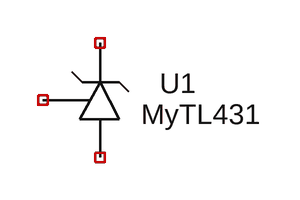
[diagram p0: schematic Draft1.asc]
Draft1.asc, the LTspice schematic file:
Version 4
SHEET 1 880 680
SYMBOL MyTL431 240 224 R0
SYMATTR InstName U1

The netlist it stands for:
* Draft1.asc
XU1 NC_01 NC_02 NC_03 MyTL431  ; pins K A REF
.lib MyTL431.sub
.backanno
.end